# EAGLE schematic _HC_Thesis_Schematic.15e804ea-fe3e-409c-88e3-dcfe19e1805c_LV1 (EAGLE 9.7.0)
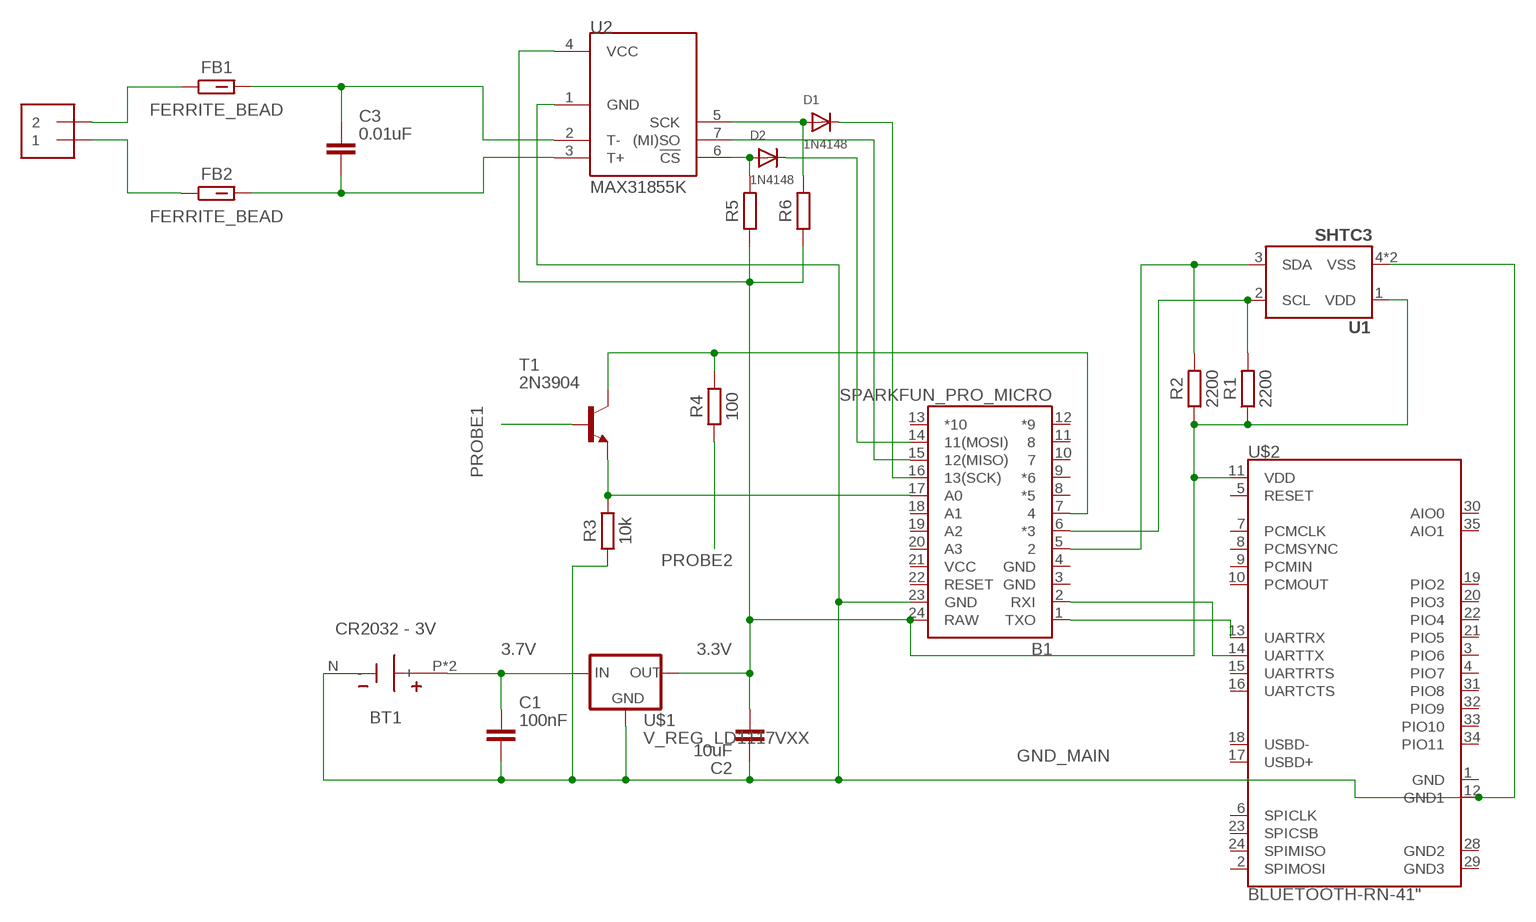
[diagram p0: schematic, sheet 1]

## Parts
B1  SPARKFUN_PRO_MICRO  [SPARKFUN_PRO_MICRO]
BT1  CR2032 - 3V  COIN-CELL-SMT-3P-3002-CR2032  [BAT_3002]
C1  100nF  C_CHIP-0402(1005-METRIC)  [CAPC1005X60]
C2  10uF  C_CHIP-0402(1005-METRIC)  [CAPC1005X60]
C3  0.01uF  C_CHIP-0805(2012-METRIC)  [CAPC2012X110]
D1  1N4148  DIODE_SOD-123FL  [SOD-123FL]
D2  1N4148  DIODE_SOD-123FL  [SOD-123FL]
FB1  FERRITE_BEAD  FBCHIP-0805(2012-METRIC)  [BEADC2012X105N]
FB2  FERRITE_BEAD  FBCHIP-0805(2012-METRIC)  [BEADC2012X105N]
J1  1X2-3.5MM  [1X2-3.5MM]
R1  2200  R_CHIP-0603(1608-METRIC)  [RESC1608X60]
R2  2200  R_CHIP-0603(1608-METRIC)  [RESC1608X60]
R3  10k  R_CHIP-0603(1608-METRIC)  [RESC1608X60]
R4  100  R_CHIP-0603(1608-METRIC)  [RESC1608X60]
R5  R_CHIP-0805(2012-METRIC)  [RESC2012X65]
R6  R_CHIP-0805(2012-METRIC)  [RESC2012X65]
T1  2N3904  [TO92]
U1  SHTC3  [SHTC3]
U2  MAX31855K  [SO08]
U$1  V_REG_LD1117VXX  [78XXL]
U$2  BLUETOOTH-RN-41"  [RN41]

## Nets
3.3V: B1.24(RAW) C2.2 R1.1 R2.1 R5.1 R6.1 U1.1(VDD) U2.4(VCC) U$1.GND(OUT) U$2.11(VDD)
3.7V: BT1.P1(+) BT1.P(+) C1.1 U$1.OUT(IN)
GND_MAIN: B1.23(GND) BT1.N(-) C1.2 C2.1 R3.1 U1.4(VSS) U1.5(VSS) U2.1(GND) U$1.IN(GND) U$2.12(GND1)
N$4: C3.1 FB1.2 U2.2(T-)
N$5: B1.1(TXO) U$2.13(UARTRX)
N$6: B1.2(RXI) U$2.14(UARTTX)
N$7: B1.7 R4.2 T1.1(C)
N$8: B1.17(A0) R3.2 T1.3(E)
N$9: C3.2 FB2.2 U2.3(T+)
N$10: B1.5 R2.2 U1.3(SDA)
N$11: B1.6(*3) R1.2 U1.2(SCL)
N$12: D2.A R5.2 U2.6(!CS)
N$13: D1.A R6.2 U2.5(SCK)
N$14: B1.15(12(MISO)) U2.7((MI)SO)
N$15: B1.16(13(SCK)) D1.C
N$16: B1.14(11(MOSI)) D2.C
N$17: FB1.1 J1.2
N$18: FB2.1 J1.1
PROBE1: T1.2(B)
PROBE2: R4.1
Unconnected: B1.8(*5) B1.9(*6) B1.10 B1.11 B1.12(*9) B1.13(*10) B1.18(A1) B1.19(A2) B1.20(A3) B1.22(RESET) U$2.1(GND) U$2.2(SPIMOSI) U$2.3(PIO6) U$2.4(PIO7) U$2.5(RESET) U$2.6(SPICLK) U$2.7(PCMCLK) U$2.8(PCMSYNC) U$2.9(PCMIN) U$2.10(PCMOUT) U$2.15(UARTRTS) U$2.16(UARTCTS) U$2.17(USBD+) U$2.18(USBD-) U$2.19(PIO2) U$2.20(PIO3) U$2.21(PIO5) U$2.22(PIO4) U$2.23(SPICSB) U$2.24(SPIMISO) U$2.28(GND2) U$2.29(GND3) U$2.30(AIO0) U$2.31(PIO8) U$2.32(PIO9) U$2.33(PIO10) U$2.34(PIO11) U$2.35(AIO1)

## Power pins joined to a net without a drawn wire
GND: B1.3(GND) B1.4(GND)
VCC: B1.21(VCC)

## Library data of the parts
B1 = SparkFun-Boards:SPARKFUN_PRO_MICRO: SparkFun Pro Micro Atmega32U4 compatible footprint. SparkFun Products: 3.3V/8MHz <https://www.sparkfun.com/products/12587> 5V/16MHz <https://www.sparkfun.com/products/12640>
BT1 = Battery_Holder:COIN-CELL-SMT-3P-?-: Battery Holders - Coin Cell SMD - CR2032, LR44, SR44 etc. Datasheet <https://docs.rs-online.com/b397/0900766b813ec0e2.pdf>; CATEGORY: Battery-Holder; CELL_DIAMETER: 20mm; DESCRIPTION: Battery Retainer Coin, 20.0mm 1 Cell SMD (SMT) Tab; MANUFACTURER: Keystone Electronics; MPN: 3002; PART_STATUS: ACTIVE; ROHS_COMPLIANT: COMPLIANT; SERIES: -; SUB_CATEGORY: Holder; TYPE: Coin Cell; VALUE: CR2032
C1-C3 = Capacitor:C: Capacitor - Generic; CATEGORY: Capacitor
D1 D2 = adafruit:DIODE: Diode SMADIODE - SMA Surface Mount Package 20V 1A Schottky Diode Digikey: 641-1014-6-ND DO-1N4148 - Through Hole Small Current Diode SOD-123 20V 1 A (.5mV Vf) Schottky Diode - Digikey: MBRX120TPMSCT-ND SOD-323 10V 570mA (.38mV Vf, 3ns) Schottky Diode - Digikey: ZLLS410CT-ND SOD-523 30V 30mA Schottky Diode (RB751S-40TE61) - Digikey: RB751S-40TE61CT-ND SOT23-R/W - SOT23 Package (R = Solder Paste/Reflow Ovens, W = Hand-Soldering) BAT54Film 40V 300mA - Digikey: 497-7162-1-ND
FB1 FB2 = Filter:FB: Ferrite Bead - Generic; CATEGORY: Filter; SUB-CATEGORY: Ferrite bead
J1 = adafruit:1X2: 3.5mm Terminal block http://www.ladyada.net/library/pcb/eaglelibrary.html
R1-R6 = Resistor:R: Resistor Fixed - Generic; CATEGORY: Resistor; SUB-CATEGORY: Fixed
T1 = transistor:2N3904: NPN TRANSISTOR
U1 = SparkFun-Sensors:SHTC3: Sensirion SHTC3 Humidity Sensor The SHTC3 is a digital humidity and temperature sensor designed especially for battery-driven high-volume consumer electronics applications.; PROD_ID: IC-14840
U2 = SparkFun-IC-Conversion:MAX31855K: Cold-Junction-Compensated K-Thermocoupleto-Digital Converter (-270°C to +1800°C) The MAX31855K performs cold-junction compensation and digitizes the signal from a type-K thermocouple. The data is output in a 14-bit resolution, SPI™-compatible, read-only format. This converter resolves temperatures to 0.25°C, allows readings as high as +1800°C and as low as -270°C, and exhibits thermocouple accuracy of ±2°C for temperatures ranging from -200°C to +700°C for K-type thermocouples. Datasheet <https://cdn.sparkfun.com/datasheets/Sensors/Temp/MAX31855K.pdf> SparkFun Products SparkFun Thermocouple Breakout - MAX31855K <https://www.sparkfun.com/products/13266> (SEN-13266); PROD_ID: IC-12578
U$1 = SparkFun-IC-Power:V_REG_LD1117VXX: LD1117VXX voltage regulator. We carry the 3.3V version (COM-00526) in TO-220 package.
U$2 = SparkFun-RF:BLUETOOTH-RN-41: Roving Networks RN-41 Bluetooth Module The RN-41 module is a small form factor, low power, class 1 Bluetooth radio that is ideal for designers who want to add wireless capability to their products without spending significant time and money developing Bluetooth-specific hardware and software. The RN-41 supports multiple interface protocols, is simple to design in, and is fully certified, making it a complete embedded Bluetooth solution. SparkFun Products: Bluetooth SMD Module - RN-41 <https://www.sparkfun.com/products/12575> (WRL-12575) Bluetooth Module Breakout - Roving Networks (RN-41 v6.15) <https://www.sparkfun.com/products/12579> (WRL-12579); PROD_ID: IC-11844; SF_ID: WRL-12575